# Altium schematic sheet SCH_05_Analog_Mux.SchDoc
size A4; SheetNumber: 10; SheetTotal: 13; SPICEModelCacheGMSWIORD: <root> / <DocumentId>GMSWIORD</DocumentId> / <CacheFrame Number="0"> / <Model Name="0603_885012206095_100nf" Kind="CKT"> / <Text>******* / .subckt 0603_885012206095_100nF 1 2 / Rser 1 3 0.0157659152881 / Lser 2 4 3.10171966E-10 / C1 3 4 0.0000001 / Rpar 3 4 5000000000 / .ends 0603_885012206095_100nF</Text> / </Model> / </CacheFrame> / </root>
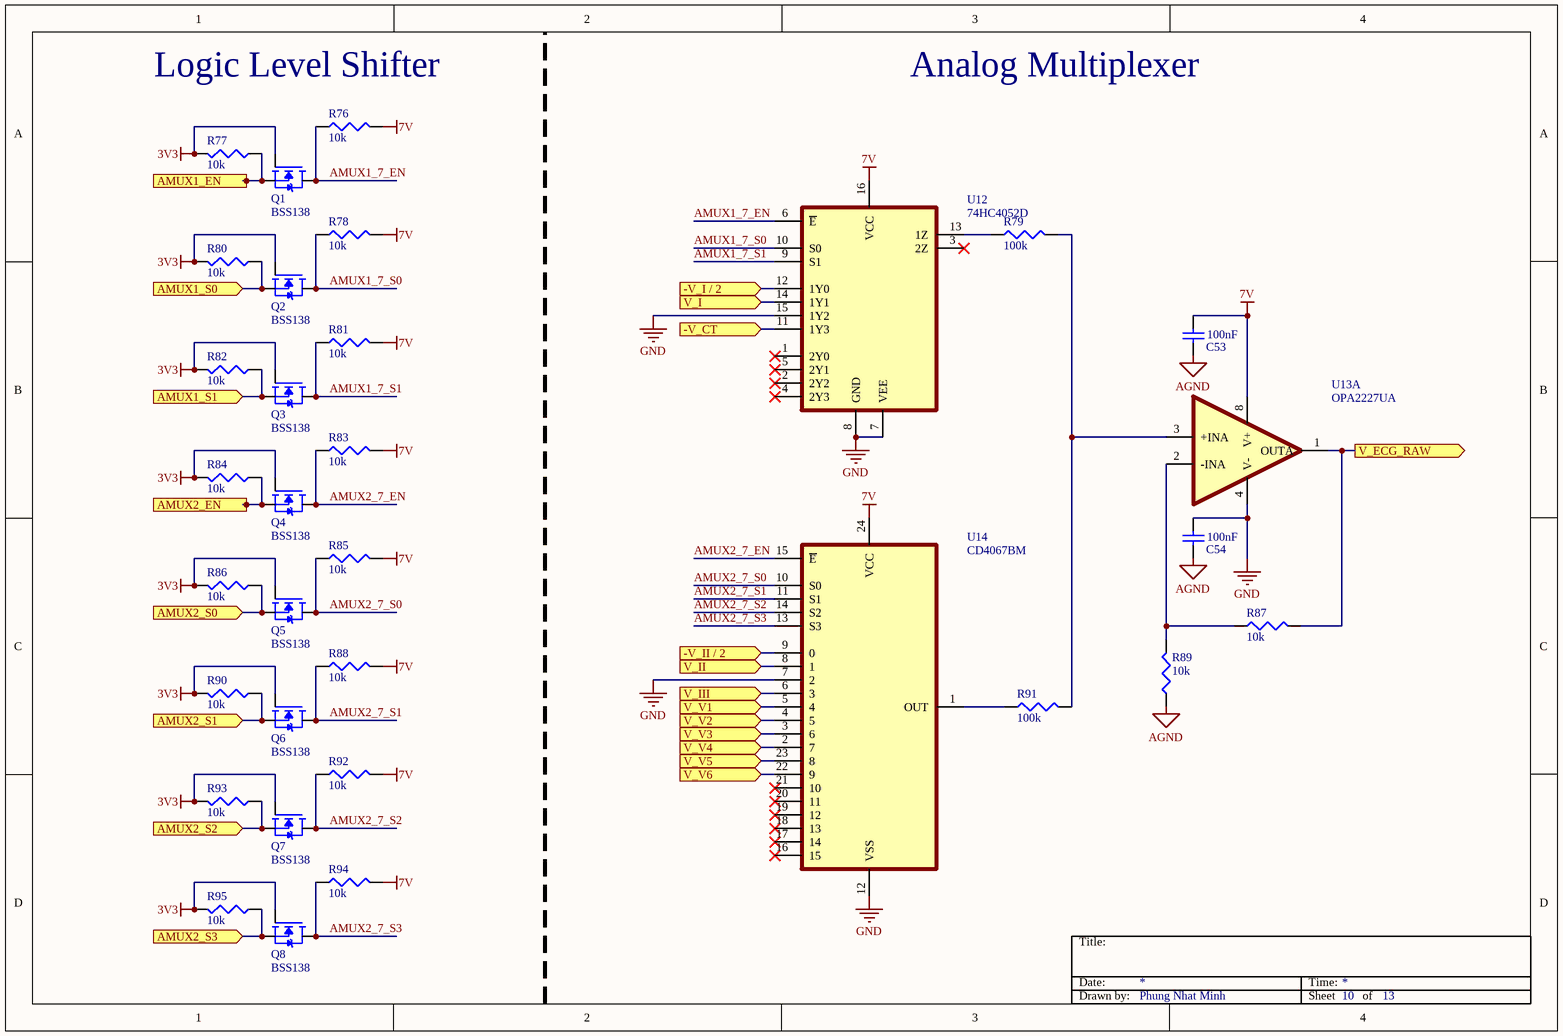
[diagram p0: SCH_05_Analog_Mux.SchDoc]

## Parts
C53  100nF  [WCAP-CSGP_0603_L1.6W0.8H0.8_Reflow]
C54  100nF  [WCAP-CSGP_0603_L1.6W0.8H0.8_Reflow]
Q1  BSS138  [SOT95P240X111-3N]
Q2  BSS138  [SOT95P240X111-3N]
Q3  BSS138  [SOT95P240X111-3N]
Q4  BSS138  [SOT95P240X111-3N]
Q5  BSS138  [SOT95P240X111-3N]
Q6  BSS138  [SOT95P240X111-3N]
Q7  BSS138  [SOT95P240X111-3N]
Q8  BSS138  [SOT95P240X111-3N]
R76  10k  [WRIS-PSMB_0603_L1.6W0.8H0.35]
R77  10k  [WRIS-PSMB_0603_L1.6W0.8H0.35]
R78  10k  [WRIS-PSMB_0603_L1.6W0.8H0.35]
R79  100k  [WRIS-PSMB_0603_L1.6W0.8H0.35]
R80  10k  [WRIS-PSMB_0603_L1.6W0.8H0.35]
R81  10k  [WRIS-PSMB_0603_L1.6W0.8H0.35]
R82  10k  [WRIS-PSMB_0603_L1.6W0.8H0.35]
R83  10k  [WRIS-PSMB_0603_L1.6W0.8H0.35]
R84  10k  [WRIS-PSMB_0603_L1.6W0.8H0.35]
R85  10k  [WRIS-PSMB_0603_L1.6W0.8H0.35]
R86  10k  [WRIS-PSMB_0603_L1.6W0.8H0.35]
R87  10k  [WRIS-PSMB_0603_L1.6W0.8H0.35]
R88  10k  [WRIS-PSMB_0603_L1.6W0.8H0.35]
R89  10k  [WRIS-PSMB_0603_L1.6W0.8H0.35]
R90  10k  [WRIS-PSMB_0603_L1.6W0.8H0.35]
R91  100k  [WRIS-PSMB_0603_L1.6W0.8H0.35]
R92  10k  [WRIS-PSMB_0603_L1.6W0.8H0.35]
R93  10k  [WRIS-PSMB_0603_L1.6W0.8H0.35]
R94  10k  [WRIS-PSMB_0603_L1.6W0.8H0.35]
R95  10k  [WRIS-PSMB_0603_L1.6W0.8H0.35]
U12  74HC4052D  [SOIC127P600X175-16N]
U13  OPA2227UA  [SOIC127P599X175-8N]  (part A of 2)
U14  CD4067BM  [SOIC127P1030X265-24N]

## Ports
-V_CT (in, see Schematic_Top[2C], SCH_04_WCT_RLD[4B]), -V_I / 2 (in, see Schematic_Top[2B], SCH_03_Instrumentation_Amplifier[2B]), -V_II / 2 (in, see Schematic_Top[2B], SCH_03_Instrumentation_Amplifier[4B]), AMUX1_EN (in, see Schematic_Top[3B], SCH_08_InOut_Terminal[2B]), AMUX1_S0 (in, see Schematic_Top[3B], SCH_08_InOut_Terminal[2B]), AMUX1_S1 (in, see Schematic_Top[3C], SCH_08_InOut_Terminal[2B]), AMUX2_EN (in, see Schematic_Top[3C], SCH_08_InOut_Terminal[3B]), AMUX2_S0 (in, see Schematic_Top[3C], SCH_08_InOut_Terminal[3B]), AMUX2_S1 (in, see Schematic_Top[3C], SCH_08_InOut_Terminal[3B]), AMUX2_S2 (in, see Schematic_Top[3C], SCH_08_InOut_Terminal[3B]), AMUX2_S3 (in, see Schematic_Top[3C], SCH_08_InOut_Terminal[3B]), V_ECG_RAW (out, see Schematic_Top[3B], SCH_06_Filter[1B]), V_I (in, see Schematic_Top[2B], SCH_03_Instrumentation_Amplifier[4C]), V_II (in, see Schematic_Top[2B], SCH_03_Instrumentation_Amplifier[4D]), V_III (in, see Schematic_Top[2B], SCH_03_Instrumentation_Amplifier[2C]), V_V1 (in, see Schematic_Top[2C], SCH_02_Electrodes[4A]), V_V2 (in, see Schematic_Top[2C], SCH_02_Electrodes[4A]), V_V3 (in, see Schematic_Top[2C], SCH_02_Electrodes[4B]), V_V4 (in, see Schematic_Top[2C], SCH_02_Electrodes[4C]), V_V5 (in, see Schematic_Top[2C], SCH_02_Electrodes[4C]), V_V6 (in, see Schematic_Top[2D], SCH_02_Electrodes[4D])

## Nets
3V3: Q1.1(G) Q2.1(G) Q3.1(G) Q4.1(G) Q5.1(G) Q6.1(G) Q7.1(G) Q8.1(G) R77.2 R80.2 R82.2 R84.2 R86.2 R90.2 R93.2 R95.2
7V: C53.2 R76.2 R78.2 R81.2 R83.2 R85.2 R88.2 R92.2 R94.2 U12.16(VCC) U13.8(V+) U14.24(VCC)
AGND: C53.1 C54.1 R89.1
GND: C54.2 U12.7(VEE) U12.8(GND) U12.15(1Y2) U13.4(V-) U14.7(2) U14.12(VSS)
-V_CT: U12.11(1Y3) ; port -V_CT
-V_I / 2: U12.12(1Y0) ; port -V_I / 2
-V_II / 2: U14.9(0) ; port -V_II / 2
AMUX1_7_EN: Q1.3(D) R76.1 U12.6(~{E})
AMUX1_7_S0: Q2.3(D) R78.1 U12.10(S0)
AMUX1_7_S1: Q3.3(D) R81.1 U12.9(S1)
AMUX1_EN: Q1.2(S) R77.1 ; port AMUX1_EN
AMUX1_S0: Q2.2(S) R80.1 ; port AMUX1_S0
AMUX1_S1: Q3.2(S) R82.1 ; port AMUX1_S1
AMUX2_7_EN: Q4.3(D) R83.1 U14.15(~{E})
AMUX2_7_S0: Q5.3(D) R85.1 U14.10(S0)
AMUX2_7_S1: Q6.3(D) R88.1 U14.11(S1)
AMUX2_7_S2: Q7.3(D) R92.1 U14.14(S2)
AMUX2_7_S3: Q8.3(D) R94.1 U14.13(S3)
AMUX2_EN: Q4.2(S) R84.1 ; port AMUX2_EN
AMUX2_S0: Q5.2(S) R86.1 ; port AMUX2_S0
AMUX2_S1: Q6.2(S) R90.1 ; port AMUX2_S1
AMUX2_S2: Q7.2(S) R93.1 ; port AMUX2_S2
AMUX2_S3: Q8.2(S) R95.1 ; port AMUX2_S3
V_ECG_RAW: R87.2 U13.1(OUTA) ; port V_ECG_RAW
V_I: U12.14(1Y1) ; port V_I
V_II: U14.8(1) ; port V_II
V_III: U14.6(3) ; port V_III
V_V1: U14.5(4) ; port V_V1
V_V2: U14.4(5) ; port V_V2
V_V3: U14.3(6) ; port V_V3
V_V4: U14.2(7) ; port V_V4
V_V5: U14.23(8) ; port V_V5
V_V6: U14.22(9) ; port V_V6
NetR79_1: R79.1 U12.13(1Z)
NetR79_2: R79.2 R91.2 U13.3(+INA)
NetR87_1: R87.1 R89.2 U13.2(-INA)
NetR91_1: R91.1 U14.1(OUT)

Not connected (* = marked no-connect by the designer): U12 1(2Y0)* 2(2Y2)* 3(2Z)* 4(2Y3)* 5(2Y1)*; U14 16(15)* 17(14)* 18(13)* 19(12)* 20(11)* 21(10)*

## Notes on the sheet
- (near R76) Logic Level Shifter
- Analog Multiplexer
- Title:
- Date:
- Time:
- Drawn by:
- Phung Nhat Minh
- Sheet
- of

## Library data of the parts
C53 C54 = 885012206095: WCAP-CSGP Multilayer Ceramic Chip Capacitor, General Purpose, size 0603, X7R, 100nF, 50VDC; Manufacturer: Wurth Elektronik; Case/Size Code: 0603; Capacitance Tolerance: +/-10%; Dissipation Factor: 3%; Insulation Resistance: 5GOhm; Rated Voltage (DC): 50V; Technical Reference: X7R0603104K050DFCT10000; Manufacturer Part Number: 885012206095; Category: Multilayer Ceramic Chip Capacitors; Match Code: WCAP-CSGP; ComponentLink1Description: Website Link; ComponentLink1URL: https://www.we-online.com/redexpert/article/885012206095?ad; ComponentLink2Description: Datasheet Link; ComponentLink2URL: https://www.we-online.com/redexpert/spec/885012206095?ad; Mount: Surface Mount; Operating Temperature Max: 125°C; Operating Temperature Min: -55°C; Packaging: Tape and Reel; Length: 1.6mm; Width: 0.8mm; Height: 0.8mm; Capacitance: 100nF; Ceramic Type: X7R
Q1-Q8 = BSS138: N-Channel 50V 220mA (Ta) 360mW (Ta) Surface Mount SOT-23-3; MF: ON Semiconductor; MP: BSS138; Price: None; SnapEDA_Link: https://www.snapeda.com/parts/BSS138/ON%20Semiconductor/view-part/4794929/?ref=snap; Availability: Good; Purchase-URL: https://pricing.snapeda.com/search/part/BSS138/?ref=eda; Value: *; Check_prices: https://www.snapeda.com/parts/BSS138/ON%20Semiconductor/view-part/4794929/?ref=eda; Package: SOT-23 ON Semiconductor
R76-R95 = 580060716001: WRIS-PSMB Metal Plate Resistor, SMT, size 0603, 0.33W, 5mΩ, +/-1%; Manufacturer: Wurth Elektronik; Case/Size Code: 0603; Rated Current: 8.12A; Technical Reference: MB0603R005F103KAATP0000; Temperature Coefficient of Resistance: +/-100ppm/°C; Manufacturer Part Number: 580060716001; Category: Metal Plate Resistors; Match Code: WRIS-PSMB; ComponentLink1Description: Website Link; ComponentLink1URL: https://www.we-online.com/redexpert/article/580060716001?ad; ComponentLink2Description: Datasheet Link; ComponentLink2URL: https://www.we-online.com/redexpert/spec/580060716001?ad; Mount: Surface Mount; Operating Temperature Max: 155°C; Operating Temperature Min: -55°C; Packaging: Tape and Reel; Length: 1.6mm; Width: 0.8mm; Height: 0.35mm; Rated Power: 0.33W; Resistance: 5mΩ; Resistance Tolerance: +/-1%
U12 = 74HC4052D: 2 Circuit IC Switch 4:1 150Ohm 16-SO; MP: 74HC4052D,653; MF: Nexperia USA; SnapEDA_Link: https://www.snapeda.com/parts/74HC4052D,653/Nexperia/view-part/32196/?ref=snap; Purchase-URL: https://pricing.snapeda.com/search/part/74HC4052D,653/?ref=eda; Availability: Good; Value: *; Price: None; Package: SO16-16 Nexperia USA Inc.; Check_prices: https://www.snapeda.com/parts/74HC4052D,653/Nexperia/view-part/32196/?ref=eda
U13 = OPA2227UA: Package: None; Price: None; Value: *; MP: OPA2227UA; Availability: Unavailable